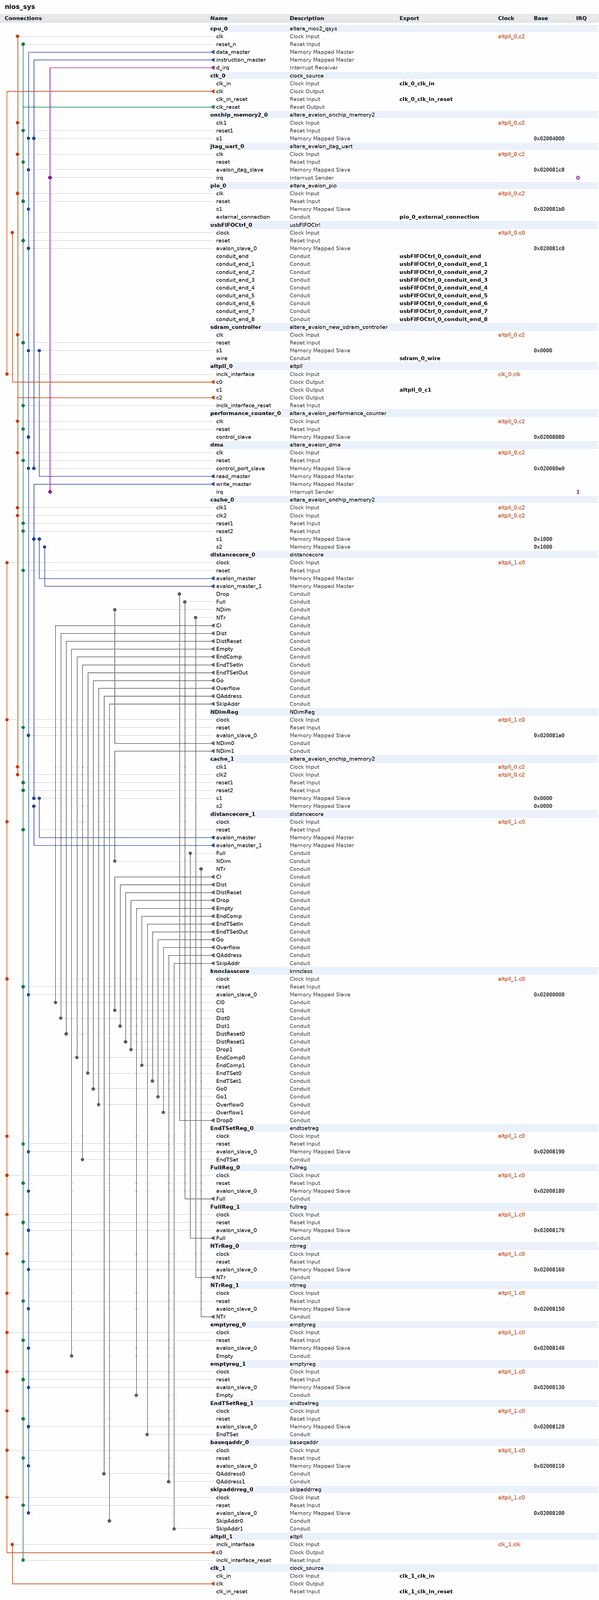
[diagram p0: system contents, whole]
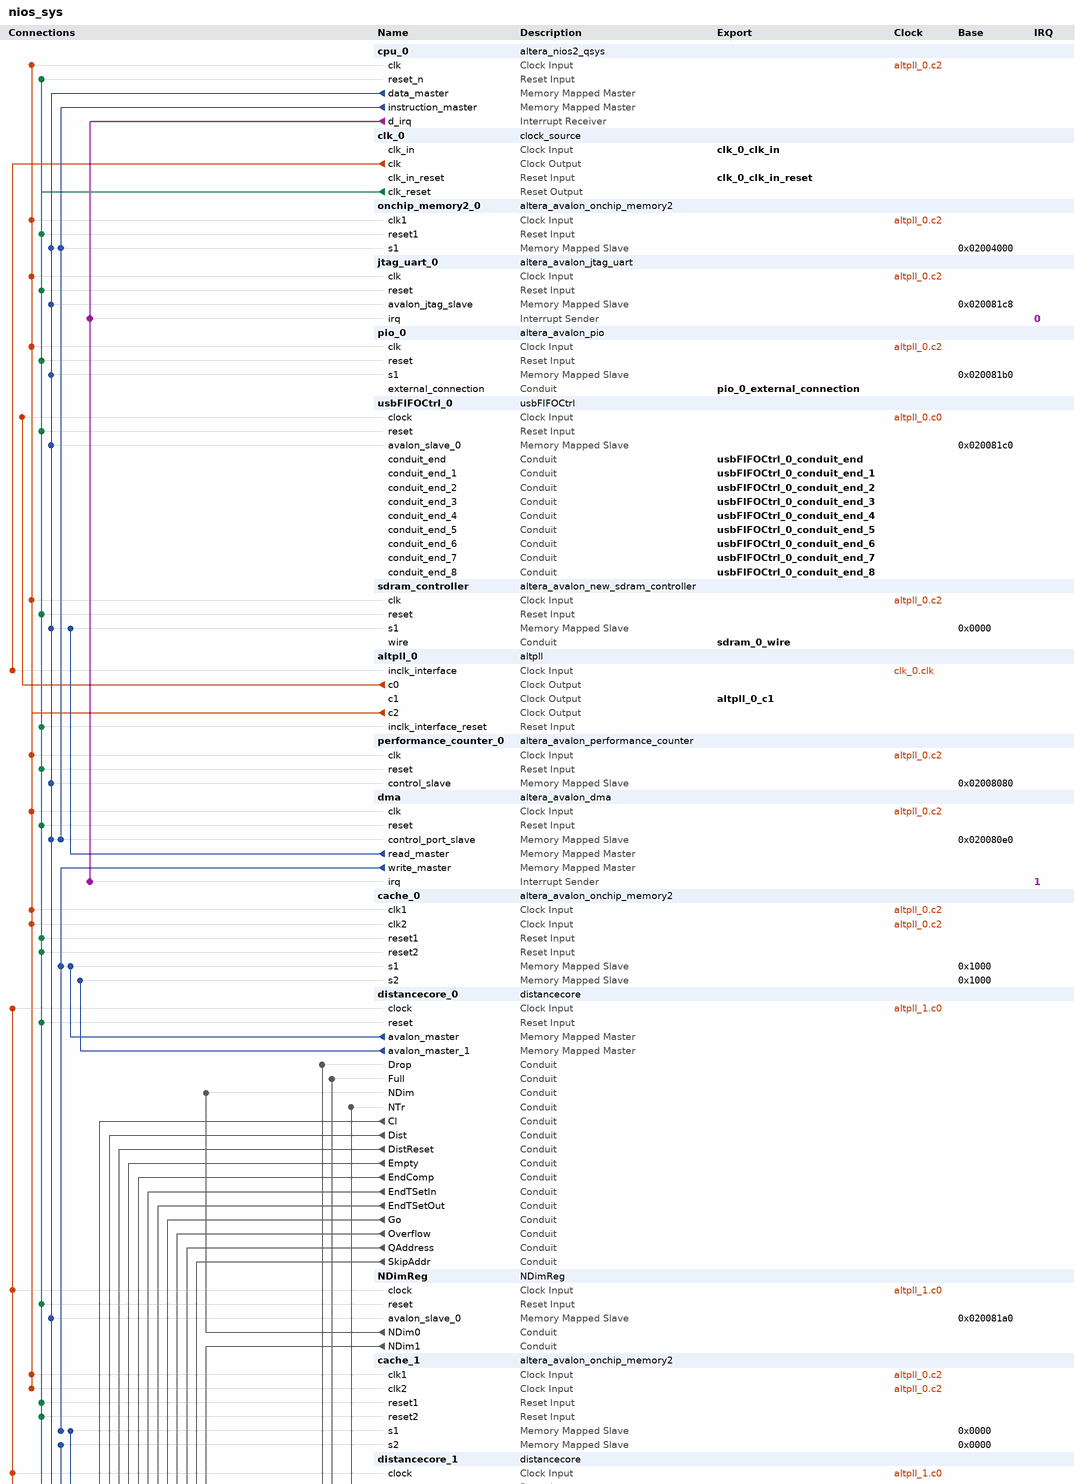
[diagram p1: system contents, upper part]
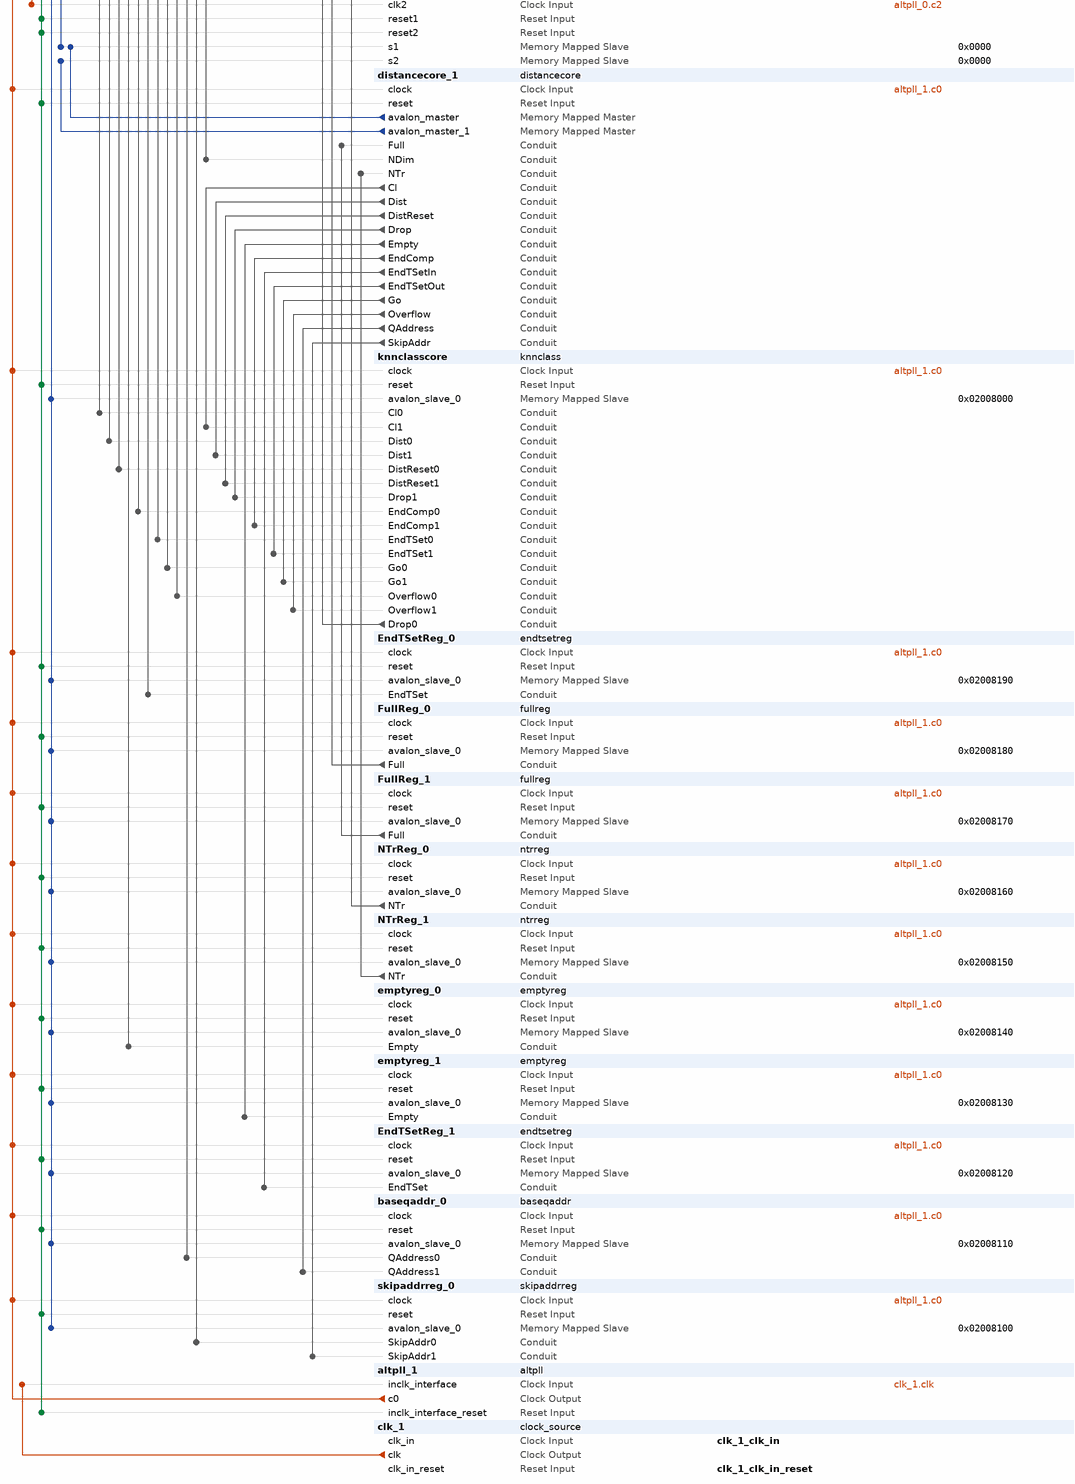
[diagram p2: system contents, lower part]
# Platform Designer (Qsys) system nios_sys, Cyclone II EP2C20F484C8
# Parameters at their usual value, and those the tool derives, are not listed.
package require -exact qsys 12.1
create_system nios_sys
set_project_property DEVICE_FAMILY {Cyclone II}
set_project_property DEVICE EP2C20F484C8

add_instance cpu_0 altera_nios2_qsys 12.1
set_instance_parameter_value cpu_0 manuallyAssignCpuID false
set_instance_parameter_value cpu_0 resetSlave onchip_memory2_0.s1
set_instance_parameter_value cpu_0 exceptionSlave onchip_memory2_0.s1
set_instance_parameter_value cpu_0 breakSlave onchip_memory2_0.s1
set_instance_parameter_value cpu_0 muldiv_multiplierType NoneSmall
set_instance_parameter_value cpu_0 impl Tiny
set_instance_parameter_value cpu_0 icache_size 4096
set_instance_parameter_value cpu_0 dcache_bursts true
set_instance_parameter_value cpu_0 debug_level NoDebug

add_instance clk_0 clock_source 12.1
set_instance_parameter_value clk_0 clockFrequency 48000000

add_instance onchip_memory2_0 altera_avalon_onchip_memory2 12.1
set_instance_parameter_value onchip_memory2_0 dataWidth 32
set_instance_parameter_value onchip_memory2_0 dualPort false
set_instance_parameter_value onchip_memory2_0 initMemContent true
set_instance_parameter_value onchip_memory2_0 initializationFileName onchip_memory2_0
set_instance_parameter_value onchip_memory2_0 memorySize 10496
set_instance_parameter_value onchip_memory2_0 useShallowMemBlocks true

add_instance jtag_uart_0 altera_avalon_jtag_uart 12.1
set_instance_parameter_value jtag_uart_0 simInteractiveOptions INTERACTIVE_ASCII_OUTPUT

add_instance pio_0 altera_avalon_pio 12.1
set_instance_parameter_value pio_0 direction Output
set_instance_parameter_value pio_0 width 8

add_instance usbFIFOCtrl_0 usbFIFOCtrl 1.0

add_instance sdram_controller altera_avalon_new_sdram_controller 12.1
set_instance_parameter_value sdram_controller TAC 5.5
set_instance_parameter_value sdram_controller TRCD 20.0
set_instance_parameter_value sdram_controller TRP 20.0
set_instance_parameter_value sdram_controller casLatency 2
set_instance_parameter_value sdram_controller columnWidth 9
set_instance_parameter_value sdram_controller dataWidth 32
set_instance_parameter_value sdram_controller generateSimulationModel false
set_instance_parameter_value sdram_controller model custom
set_instance_parameter_value sdram_controller numberOfBanks 4
set_instance_parameter_value sdram_controller numberOfChipSelects 1
set_instance_parameter_value sdram_controller powerUpDelay 100.0
set_instance_parameter_value sdram_controller refreshPeriod 15.625
set_instance_parameter_value sdram_controller rowWidth 12

add_instance altpll_0 altpll 12.1
set_instance_parameter_value altpll_0 INCLK0_INPUT_FREQUENCY 20833
set_instance_parameter_value altpll_0 GATE_LOCK_SIGNAL NO
set_instance_parameter_value altpll_0 VALID_LOCK_MULTIPLIER 1
set_instance_parameter_value altpll_0 INVALID_LOCK_MULTIPLIER 5
set_instance_parameter_value altpll_0 CLK0_MULTIPLY_BY 1
set_instance_parameter_value altpll_0 CLK1_MULTIPLY_BY 3
set_instance_parameter_value altpll_0 CLK2_MULTIPLY_BY 3
set_instance_parameter_value altpll_0 CLK0_DIVIDE_BY 1
set_instance_parameter_value altpll_0 CLK1_DIVIDE_BY 1
set_instance_parameter_value altpll_0 CLK2_DIVIDE_BY 1
set_instance_parameter_value altpll_0 CLK1_PHASE_SHIFT 0
set_instance_parameter_value altpll_0 CLK2_PHASE_SHIFT 0
set_instance_parameter_value altpll_0 CLK1_DUTY_CYCLE 50
set_instance_parameter_value altpll_0 CLK2_DUTY_CYCLE 50
set_instance_parameter_value altpll_0 PORT_clk1 PORT_USED
set_instance_parameter_value altpll_0 PORT_clk2 PORT_USED
set_instance_parameter_value altpll_0 PORT_clk3 PORT_UNUSED
set_instance_parameter_value altpll_0 PORT_ARESET PORT_UNUSED
set_instance_parameter_value altpll_0 PORT_LOCKED PORT_UNUSED

add_instance performance_counter_0 altera_avalon_performance_counter 12.1
set_instance_parameter_value performance_counter_0 numberOfSections 2

add_instance dma altera_avalon_dma 12.1
set_instance_parameter_value dma allowByteTransactions false
set_instance_parameter_value dma allowDoubleWordTransactions false
set_instance_parameter_value dma allowHalfWordTransactions false
set_instance_parameter_value dma allowQuadWordTransactions false
set_instance_parameter_value dma burstEnable false
set_instance_parameter_value dma fifoDepth 4
set_instance_parameter_value dma maxBurstSize 8
set_instance_parameter_value dma minimumDmaTransactionRegisterWidth 32
set_instance_parameter_value dma useRegistersForFIFO true

add_instance cache_0 altera_avalon_onchip_memory2 12.1
set_instance_parameter_value cache_0 blockType M4K
set_instance_parameter_value cache_0 dataWidth 32
set_instance_parameter_value cache_0 dualPort true
set_instance_parameter_value cache_0 initMemContent false
set_instance_parameter_value cache_0 initializationFileName cache_0
set_instance_parameter_value cache_0 memorySize 2048
set_instance_parameter_value cache_0 useShallowMemBlocks true

add_instance distancecore_0 distancecore 1.0

add_instance NDimReg NDimReg 1.0

add_instance cache_1 altera_avalon_onchip_memory2 12.1
set_instance_parameter_value cache_1 blockType M4K
set_instance_parameter_value cache_1 dataWidth 32
set_instance_parameter_value cache_1 dualPort true
set_instance_parameter_value cache_1 initMemContent false
set_instance_parameter_value cache_1 initializationFileName cache_1
set_instance_parameter_value cache_1 memorySize 2048
set_instance_parameter_value cache_1 useShallowMemBlocks true

add_instance distancecore_1 distancecore 1.0

add_instance knnclasscore knnclass 1.0

add_instance EndTSetReg_0 endtsetreg 1.0

add_instance FullReg_0 fullreg 1.0

add_instance FullReg_1 fullreg 1.0

add_instance NTrReg_0 ntrreg 1.0

add_instance NTrReg_1 ntrreg 1.0

add_instance emptyreg_0 emptyreg 1.0

add_instance emptyreg_1 emptyreg 1.0

add_instance EndTSetReg_1 endtsetreg 1.0

add_instance baseqaddr_0 baseqaddr 1.0

add_instance skipaddrreg_0 skipaddrreg 1.0

add_instance altpll_1 altpll 12.1
set_instance_parameter_value altpll_1 INCLK0_INPUT_FREQUENCY 41666
set_instance_parameter_value altpll_1 GATE_LOCK_SIGNAL NO
set_instance_parameter_value altpll_1 VALID_LOCK_MULTIPLIER 1
set_instance_parameter_value altpll_1 INVALID_LOCK_MULTIPLIER 5
set_instance_parameter_value altpll_1 CLK0_MULTIPLY_BY 4
set_instance_parameter_value altpll_1 CLK1_MULTIPLY_BY 3
set_instance_parameter_value altpll_1 CLK2_MULTIPLY_BY 3
set_instance_parameter_value altpll_1 CLK0_DIVIDE_BY 1
set_instance_parameter_value altpll_1 CLK1_DIVIDE_BY 1
set_instance_parameter_value altpll_1 CLK2_DIVIDE_BY 1
set_instance_parameter_value altpll_1 CLK1_PHASE_SHIFT 0
set_instance_parameter_value altpll_1 CLK2_PHASE_SHIFT 0
set_instance_parameter_value altpll_1 CLK1_DUTY_CYCLE 50
set_instance_parameter_value altpll_1 CLK2_DUTY_CYCLE 50
set_instance_parameter_value altpll_1 PORT_clk1 PORT_UNUSED
set_instance_parameter_value altpll_1 PORT_clk2 PORT_UNUSED
set_instance_parameter_value altpll_1 PORT_clk3 PORT_UNUSED
set_instance_parameter_value altpll_1 PORT_ARESET PORT_UNUSED
set_instance_parameter_value altpll_1 PORT_LOCKED PORT_UNUSED

add_instance clk_1 clock_source 12.1
set_instance_parameter_value clk_1 clockFrequency 24000000

# connections
add_connection altpll_0.c0 usbFIFOCtrl_0.clock clock
add_connection altpll_0.c2 cache_0.clk1 clock
add_connection altpll_0.c2 cache_0.clk2 clock
add_connection altpll_0.c2 cache_1.clk1 clock
add_connection altpll_0.c2 cache_1.clk2 clock
add_connection altpll_0.c2 cpu_0.clk clock
add_connection altpll_0.c2 dma.clk clock
add_connection altpll_0.c2 jtag_uart_0.clk clock
add_connection altpll_0.c2 onchip_memory2_0.clk1 clock
add_connection altpll_0.c2 performance_counter_0.clk clock
add_connection altpll_0.c2 pio_0.clk clock
add_connection altpll_0.c2 sdram_controller.clk clock
add_connection altpll_1.c0 baseqaddr_0.clock clock
add_connection altpll_1.c0 distancecore_0.clock clock
add_connection altpll_1.c0 distancecore_1.clock clock
add_connection altpll_1.c0 emptyreg_0.clock clock
add_connection altpll_1.c0 emptyreg_1.clock clock
add_connection altpll_1.c0 EndTSetReg_0.clock clock
add_connection altpll_1.c0 EndTSetReg_1.clock clock
add_connection altpll_1.c0 FullReg_0.clock clock
add_connection altpll_1.c0 FullReg_1.clock clock
add_connection altpll_1.c0 knnclasscore.clock clock
add_connection altpll_1.c0 NDimReg.clock clock
add_connection altpll_1.c0 NTrReg_0.clock clock
add_connection altpll_1.c0 NTrReg_1.clock clock
add_connection altpll_1.c0 skipaddrreg_0.clock clock
add_connection clk_0.clk altpll_0.inclk_interface clock
add_connection clk_1.clk altpll_1.inclk_interface clock
add_connection clk_0.clk_reset altpll_0.inclk_interface_reset reset
add_connection clk_0.clk_reset altpll_1.inclk_interface_reset reset
add_connection clk_0.clk_reset baseqaddr_0.reset reset
add_connection clk_0.clk_reset cache_0.reset1 reset
add_connection clk_0.clk_reset cache_0.reset2 reset
add_connection clk_0.clk_reset cache_1.reset1 reset
add_connection clk_0.clk_reset cache_1.reset2 reset
add_connection clk_0.clk_reset cpu_0.reset_n reset
add_connection clk_0.clk_reset distancecore_0.reset reset
add_connection clk_0.clk_reset distancecore_1.reset reset
add_connection clk_0.clk_reset dma.reset reset
add_connection clk_0.clk_reset emptyreg_0.reset reset
add_connection clk_0.clk_reset emptyreg_1.reset reset
add_connection clk_0.clk_reset EndTSetReg_0.reset reset
add_connection clk_0.clk_reset EndTSetReg_1.reset reset
add_connection clk_0.clk_reset FullReg_0.reset reset
add_connection clk_0.clk_reset FullReg_1.reset reset
add_connection clk_0.clk_reset jtag_uart_0.reset reset
add_connection clk_0.clk_reset knnclasscore.reset reset
add_connection clk_0.clk_reset NDimReg.reset reset
add_connection clk_0.clk_reset NTrReg_0.reset reset
add_connection clk_0.clk_reset NTrReg_1.reset reset
add_connection clk_0.clk_reset onchip_memory2_0.reset1 reset
add_connection clk_0.clk_reset performance_counter_0.reset reset
add_connection clk_0.clk_reset pio_0.reset reset
add_connection clk_0.clk_reset sdram_controller.reset reset
add_connection clk_0.clk_reset skipaddrreg_0.reset reset
add_connection clk_0.clk_reset usbFIFOCtrl_0.reset reset
add_connection cpu_0.data_master baseqaddr_0.avalon_slave_0 avalon
set_connection_parameter_value cpu_0.data_master/baseqaddr_0.avalon_slave_0 baseAddress 0x02008110
add_connection cpu_0.data_master dma.control_port_slave avalon
set_connection_parameter_value cpu_0.data_master/dma.control_port_slave baseAddress 0x020080e0
add_connection cpu_0.data_master emptyreg_0.avalon_slave_0 avalon
set_connection_parameter_value cpu_0.data_master/emptyreg_0.avalon_slave_0 baseAddress 0x02008140
add_connection cpu_0.data_master emptyreg_1.avalon_slave_0 avalon
set_connection_parameter_value cpu_0.data_master/emptyreg_1.avalon_slave_0 baseAddress 0x02008130
add_connection cpu_0.data_master EndTSetReg_0.avalon_slave_0 avalon
set_connection_parameter_value cpu_0.data_master/EndTSetReg_0.avalon_slave_0 baseAddress 0x02008190
add_connection cpu_0.data_master EndTSetReg_1.avalon_slave_0 avalon
set_connection_parameter_value cpu_0.data_master/EndTSetReg_1.avalon_slave_0 baseAddress 0x02008120
add_connection cpu_0.data_master FullReg_0.avalon_slave_0 avalon
set_connection_parameter_value cpu_0.data_master/FullReg_0.avalon_slave_0 baseAddress 0x02008180
add_connection cpu_0.data_master FullReg_1.avalon_slave_0 avalon
set_connection_parameter_value cpu_0.data_master/FullReg_1.avalon_slave_0 baseAddress 0x02008170
add_connection cpu_0.data_master jtag_uart_0.avalon_jtag_slave avalon
set_connection_parameter_value cpu_0.data_master/jtag_uart_0.avalon_jtag_slave baseAddress 0x020081c8
add_connection cpu_0.data_master knnclasscore.avalon_slave_0 avalon
set_connection_parameter_value cpu_0.data_master/knnclasscore.avalon_slave_0 baseAddress 0x02008000
add_connection cpu_0.data_master NDimReg.avalon_slave_0 avalon
set_connection_parameter_value cpu_0.data_master/NDimReg.avalon_slave_0 baseAddress 0x020081a0
add_connection cpu_0.data_master NTrReg_0.avalon_slave_0 avalon
set_connection_parameter_value cpu_0.data_master/NTrReg_0.avalon_slave_0 baseAddress 0x02008160
add_connection cpu_0.data_master NTrReg_1.avalon_slave_0 avalon
set_connection_parameter_value cpu_0.data_master/NTrReg_1.avalon_slave_0 baseAddress 0x02008150
add_connection cpu_0.data_master onchip_memory2_0.s1 avalon
set_connection_parameter_value cpu_0.data_master/onchip_memory2_0.s1 baseAddress 0x02004000
add_connection cpu_0.data_master performance_counter_0.control_slave avalon
set_connection_parameter_value cpu_0.data_master/performance_counter_0.control_slave baseAddress 0x02008080
add_connection cpu_0.data_master pio_0.s1 avalon
set_connection_parameter_value cpu_0.data_master/pio_0.s1 baseAddress 0x020081b0
add_connection cpu_0.data_master sdram_controller.s1 avalon
set_connection_parameter_value cpu_0.data_master/sdram_controller.s1 baseAddress 0x0000
add_connection cpu_0.data_master skipaddrreg_0.avalon_slave_0 avalon
set_connection_parameter_value cpu_0.data_master/skipaddrreg_0.avalon_slave_0 baseAddress 0x02008100
add_connection cpu_0.data_master usbFIFOCtrl_0.avalon_slave_0 avalon
set_connection_parameter_value cpu_0.data_master/usbFIFOCtrl_0.avalon_slave_0 baseAddress 0x020081c0
add_connection cpu_0.instruction_master dma.control_port_slave avalon
set_connection_parameter_value cpu_0.instruction_master/dma.control_port_slave baseAddress 0x020080e0
add_connection cpu_0.instruction_master onchip_memory2_0.s1 avalon
set_connection_parameter_value cpu_0.instruction_master/onchip_memory2_0.s1 baseAddress 0x02004000
add_connection distancecore_0.avalon_master cache_0.s1 avalon
set_connection_parameter_value distancecore_0.avalon_master/cache_0.s1 baseAddress 0x1000
add_connection distancecore_0.avalon_master_1 cache_0.s2 avalon
set_connection_parameter_value distancecore_0.avalon_master_1/cache_0.s2 baseAddress 0x1000
add_connection distancecore_1.avalon_master cache_1.s1 avalon
set_connection_parameter_value distancecore_1.avalon_master/cache_1.s1 baseAddress 0x0000
add_connection distancecore_1.avalon_master_1 cache_1.s2 avalon
set_connection_parameter_value distancecore_1.avalon_master_1/cache_1.s2 baseAddress 0x0000
add_connection dma.read_master sdram_controller.s1 avalon
set_connection_parameter_value dma.read_master/sdram_controller.s1 baseAddress 0x0000
add_connection dma.write_master cache_0.s1 avalon
set_connection_parameter_value dma.write_master/cache_0.s1 baseAddress 0x1000
add_connection dma.write_master cache_1.s1 avalon
set_connection_parameter_value dma.write_master/cache_1.s1 baseAddress 0x0000
add_connection distancecore_0.Cl knnclasscore.Cl0 conduit
add_connection distancecore_0.Dist knnclasscore.Dist0 conduit
add_connection distancecore_0.DistReset knnclasscore.DistReset0 conduit
add_connection distancecore_0.Empty emptyreg_0.Empty conduit
add_connection distancecore_0.EndComp knnclasscore.EndComp0 conduit
add_connection distancecore_0.EndTSetIn EndTSetReg_0.EndTSet conduit
add_connection distancecore_0.EndTSetOut knnclasscore.EndTSet0 conduit
add_connection distancecore_0.Go knnclasscore.Go0 conduit
add_connection distancecore_0.Overflow knnclasscore.Overflow0 conduit
add_connection distancecore_0.QAddress baseqaddr_0.QAddress0 conduit
add_connection distancecore_0.SkipAddr skipaddrreg_0.SkipAddr0 conduit
add_connection distancecore_1.Cl knnclasscore.Cl1 conduit
add_connection distancecore_1.Dist knnclasscore.Dist1 conduit
add_connection distancecore_1.DistReset knnclasscore.DistReset1 conduit
add_connection distancecore_1.Drop knnclasscore.Drop1 conduit
add_connection distancecore_1.Empty emptyreg_1.Empty conduit
add_connection distancecore_1.EndComp knnclasscore.EndComp1 conduit
add_connection distancecore_1.EndTSetIn EndTSetReg_1.EndTSet conduit
add_connection distancecore_1.EndTSetOut knnclasscore.EndTSet1 conduit
add_connection distancecore_1.Go knnclasscore.Go1 conduit
add_connection distancecore_1.Overflow knnclasscore.Overflow1 conduit
add_connection distancecore_1.QAddress baseqaddr_0.QAddress1 conduit
add_connection distancecore_1.SkipAddr skipaddrreg_0.SkipAddr1 conduit
add_connection FullReg_0.Full distancecore_0.Full conduit
add_connection FullReg_1.Full distancecore_1.Full conduit
add_connection knnclasscore.Drop0 distancecore_0.Drop conduit
add_connection NDimReg.NDim0 distancecore_0.NDim conduit
add_connection NDimReg.NDim1 distancecore_1.NDim conduit
add_connection NTrReg_0.NTr distancecore_0.NTr conduit
add_connection NTrReg_1.NTr distancecore_1.NTr conduit
add_connection cpu_0.d_irq dma.irq interrupt
set_connection_parameter_value cpu_0.d_irq/dma.irq irqNumber 1
add_connection cpu_0.d_irq jtag_uart_0.irq interrupt
set_connection_parameter_value cpu_0.d_irq/jtag_uart_0.irq irqNumber 0

# exported interfaces
add_interface usbFIFOCtrl_0_conduit_end conduit end
set_interface_property usbFIFOCtrl_0_conduit_end EXPORT_OF usbFIFOCtrl_0.conduit_end
add_interface clk_0_clk_in_reset reset sink
set_interface_property clk_0_clk_in_reset EXPORT_OF clk_0.clk_in_reset
add_interface sdram_0_wire conduit end
set_interface_property sdram_0_wire EXPORT_OF sdram_controller.wire
add_interface pio_0_external_connection conduit end
set_interface_property pio_0_external_connection EXPORT_OF pio_0.external_connection
add_interface usbFIFOCtrl_0_conduit_end_8 conduit end
set_interface_property usbFIFOCtrl_0_conduit_end_8 EXPORT_OF usbFIFOCtrl_0.conduit_end_8
add_interface usbFIFOCtrl_0_conduit_end_7 conduit end
set_interface_property usbFIFOCtrl_0_conduit_end_7 EXPORT_OF usbFIFOCtrl_0.conduit_end_7
add_interface usbFIFOCtrl_0_conduit_end_6 conduit end
set_interface_property usbFIFOCtrl_0_conduit_end_6 EXPORT_OF usbFIFOCtrl_0.conduit_end_6
add_interface usbFIFOCtrl_0_conduit_end_5 conduit end
set_interface_property usbFIFOCtrl_0_conduit_end_5 EXPORT_OF usbFIFOCtrl_0.conduit_end_5
add_interface usbFIFOCtrl_0_conduit_end_4 conduit end
set_interface_property usbFIFOCtrl_0_conduit_end_4 EXPORT_OF usbFIFOCtrl_0.conduit_end_4
add_interface usbFIFOCtrl_0_conduit_end_3 conduit end
set_interface_property usbFIFOCtrl_0_conduit_end_3 EXPORT_OF usbFIFOCtrl_0.conduit_end_3
add_interface usbFIFOCtrl_0_conduit_end_2 conduit end
set_interface_property usbFIFOCtrl_0_conduit_end_2 EXPORT_OF usbFIFOCtrl_0.conduit_end_2
add_interface clk_0_clk_in clock sink
set_interface_property clk_0_clk_in EXPORT_OF clk_0.clk_in
add_interface usbFIFOCtrl_0_conduit_end_1 conduit end
set_interface_property usbFIFOCtrl_0_conduit_end_1 EXPORT_OF usbFIFOCtrl_0.conduit_end_1
add_interface clk_1_clk_in clock sink
set_interface_property clk_1_clk_in EXPORT_OF clk_1.clk_in
add_interface clk_1_clk_in_reset reset sink
set_interface_property clk_1_clk_in_reset EXPORT_OF clk_1.clk_in_reset
add_interface altpll_0_c1 clock source
set_interface_property altpll_0_c1 EXPORT_OF altpll_0.c1

save_system nios_sys.qsys
